# Altium schematic sheet OTHER.schdoc
size C; SheetNumber: 7; SheetTotal: 8
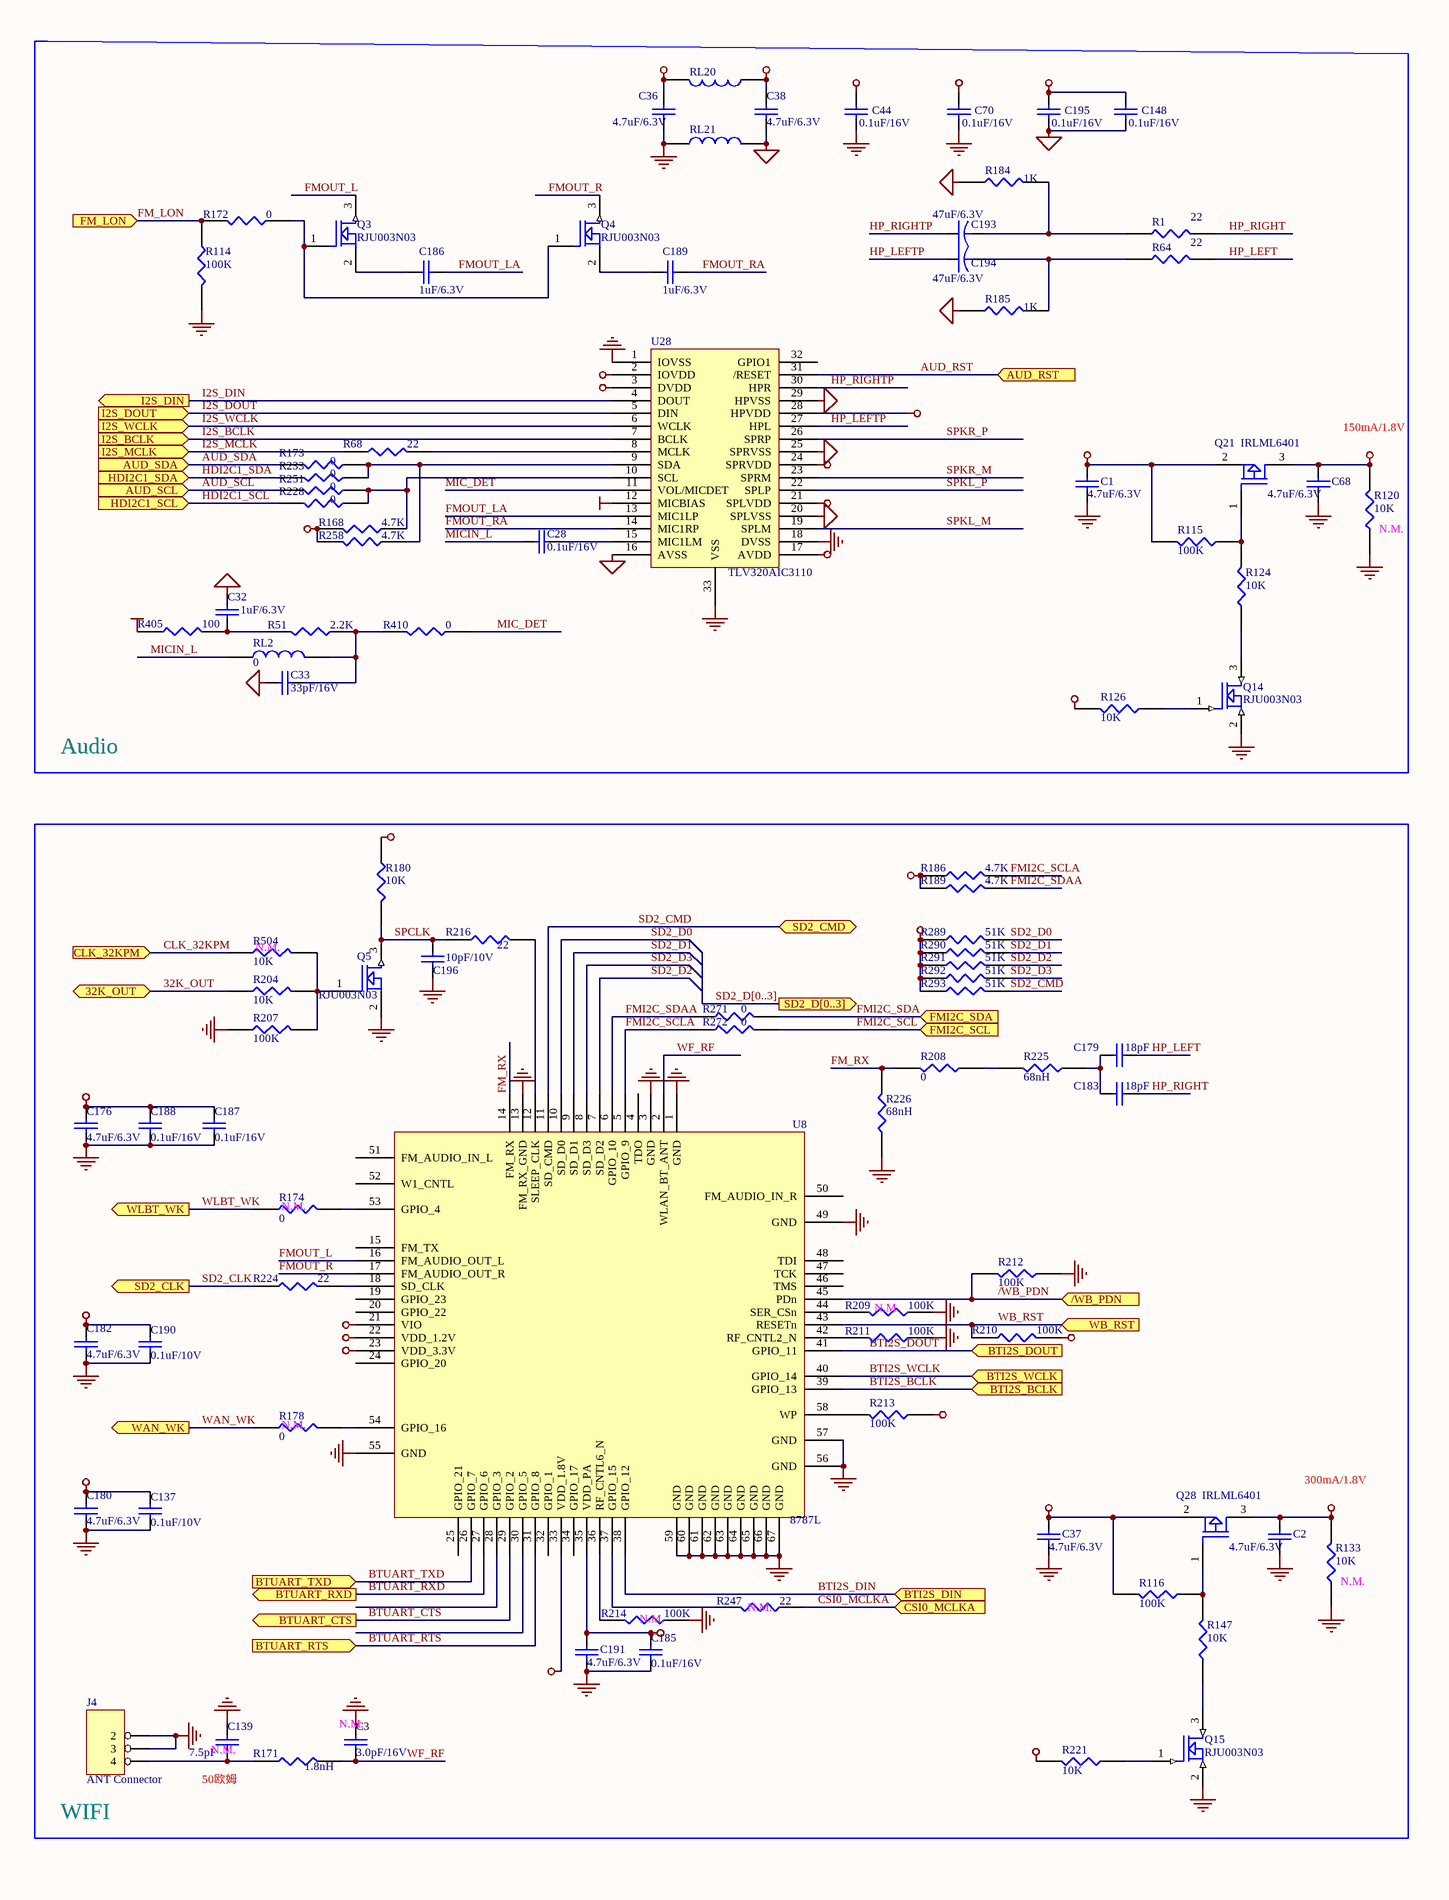
[diagram p0: OTHER.schdoc, left]
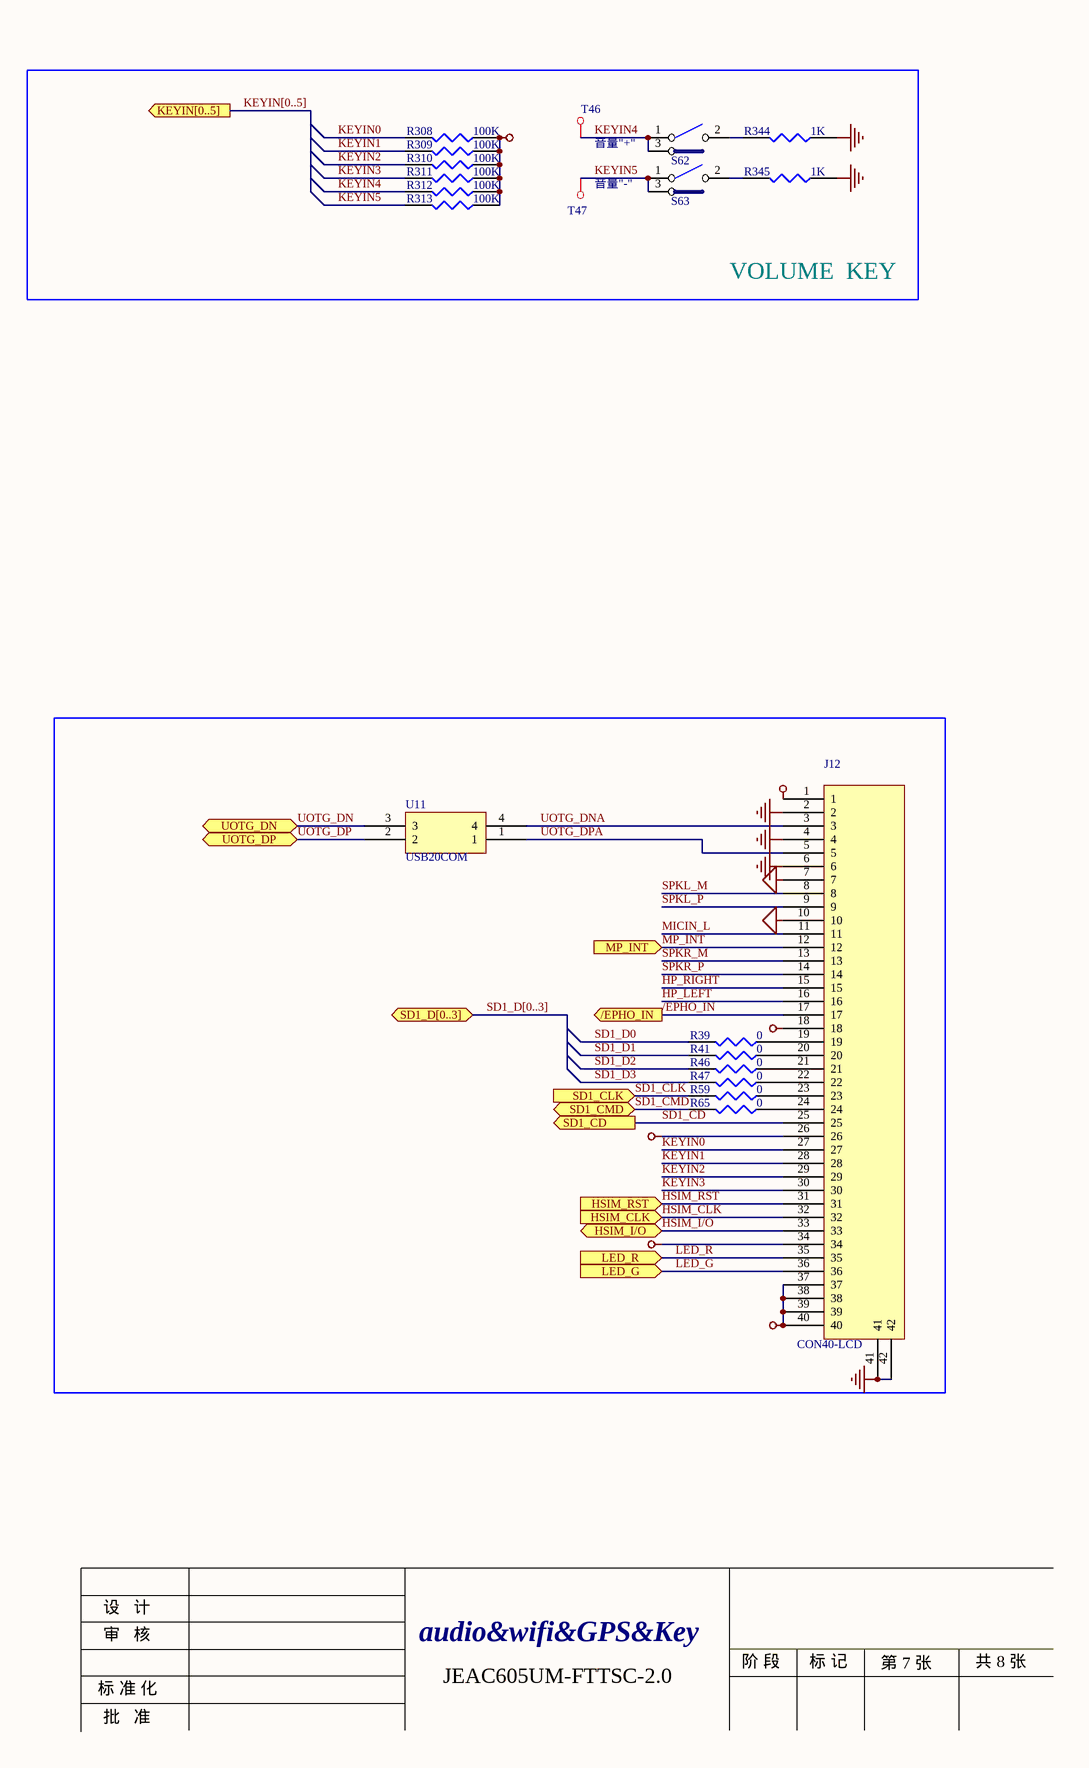
[diagram p1: OTHER.schdoc, right]

## Parts
C1  4.7uF/6.3V  [C0603]
C2  4.7uF/6.3V  [C0603]
C3  3.0pF/16V  [C0402]
C28  0.1uF/16V  [C0402]
C32  1uF/6.3V  [C0402]
C33  33pF/16V  [C0402]
C36  4.7uF/6.3V  [C0603]
C37  4.7uF/6.3V  [C0603]
C38  4.7uF/6.3V  [C0603]
C44  0.1uF/16V  [C0402]
C68  4.7uF/6.3V  [C0603]
C70  0.1uF/16V  [C0402]
C137  0.1uF/10V  [C0402]
C139  7.5pF  [C0402]
C148  0.1uF/16V  [C0402]
C176  4.7uF/6.3V  [C0603]
C179  18pF  [C0402]
C180  4.7uF/6.3V  [C0603]
C182  4.7uF/6.3V  [C0603]
C183  18pF  [C0402]
C185  0.1uF/16V  [C0402]
C186  1uF/6.3V  [C0402]
C187  0.1uF/16V  [C0402]
C188  0.1uF/16V  [C0402]
C189  1uF/6.3V  [C0402]
C190  0.1uF/10V  [C0402]
C191  4.7uF/6.3V  [C0603]
C193  47uF/6.3V  [C1206B1]
C194  47uF/6.3V  [C1206B1]
C195  0.1uF/16V  [C0402]
C196  10pF/10V  [C0402]
J4  ANT Connector  [J-AT-3-50-H]
J12  CON40-LCD  [j-con-40-0_5]
Q3  RJU003N03  [SOT-23-NPN]
Q4  RJU003N03  [SOT-23-NPN]
Q5  RJU003N03  [SOT-23-NPN]
Q14  RJU003N03  [SOT-23-NPN]
Q15  RJU003N03  [SOT-23-NPN]
Q21  IRLML6401  [SOT-23]
Q28  IRLML6401  [SOT-23]
R1  22  [R0402]
R39  0  [R0402]
R41  0  [R0402]
R46  0  [R0402]
R47  0  [R0402]
R51  2.2K  [R0402]
R59  0  [R0402]
R64  22  [R0402]
R65  0  [R0402]
R68  22  [R0402]
R114  100K  [R0402]
R115  100K  [R0402]
R116  100K  [R0402]
R120  10K  [R0402]
R124  10K  [R0402]
R126  10K  [R0402]
R133  10K  [R0402]
R147  10K  [R0402]
R168  4.7K  [R0402]
R171  1.8nH  [R0402]
R172  0  [R0402]
R173  0  [R0402]
R174  0  [R0402]
R178  0  [R0402]
R180  10K  [R0402]
R184  1K  [R0402]
R185  1K  [R0402]
R186  4.7K  [R0402]
R189  4.7K  [R0402]
R204  10K  [R0402]
R207  100K  [R0402]
R208  0  [R0402]
R209  100K  [R0402]
R210  100K  [R0402]
R211  100K  [R0402]
R212  100K  [R0402]
R213  100K  [R0402]
R214  100K  [R0402]
R216  22  [R0402]
R221  10K  [R0402]
R224  22  [R0402]
R225  68nH  [R0402]
R226  68nH  [R0402]
R228  0  [R0402]
R233  0  [R0402]
R247  22  [R0402]
R251  0  [R0402]
R258  4.7K  [R0402]
R271  0  [R0402]
R272  0  [R0402]
R289  51K  [R0402]
R290  51K  [R0402]
R291  51K  [R0402]
R292  51K  [R0402]
R293  51K  [R0402]
R308  100K  [R0402]
R309  100K  [R0402]
R310  100K  [R0402]
R311  100K  [R0402]
R312  100K  [R0402]
R313  100K  [R0402]
R344  1K  [R0402]
R345  1K  [R0402]
R405  100  [R0402]
R410  0  [R0402]
R504  10K  [R0402]
RL2  0  [L0402]
RL20  (no value)  [L0603]
RL21  (no value)  [L0603]
S62  SW SPST_side  [J-SW-3-1_225]  (value not drawn)
S63  SW SPST_side  [J-SW-3-1_225]  (value not drawn)
T46  Testpoint  [TP2_0]  (value not drawn)
T47  Testpoint  [TP2_0]  (value not drawn)
U8  8787L  [U-WM-67-0_605]
U11  USB20COM  [F-CHOKE-4-0805]
U28  TLV320AIC3110  [U-QFN-32-0_5]

## Blocks framed on the sheet
Audio: C1 C28 C32 C33 C36 C38 C44 C68 C70 C148 C186 C189 C193-C195 Q3 Q4 Q14 Q21 R1 R51 R64 R68 R114 R115 R120 R124 R126 R168 R172 R173 R184 R185 R228 R233 R251 R258 R405 R410 RL2 RL20 RL21 U28
VOLUME  KEY: R308-R313 R344 R345 S62 S63 T46 T47
WIFI: C2 C3 C37 C137 C139 C176 C179 C180 C182 C183 C185 C187 C188 C190 C191 C196 J4 Q5 Q15 Q28 R116 R133 R147 R171 R174 R178 R180 R186 R189 R204 R207-R214 R216 R221 R224-R226 R247 R271 R272 R289-R293 R504 U8

## Ports
32K_OUT (bidir), /EPHO_IN (out), /WB_PDN (in), AUD_RST (in), AUD_SCL (in), AUD_SDA (in), BTI2S_BCLK (in), BTI2S_DIN (in), BTI2S_DOUT (in), BTI2S_WCLK (in), BTUART_CTS (out), BTUART_RTS (in), BTUART_RXD (out), BTUART_TXD (in), CLK_32KPM (in), CSI0_MCLKA (in), FM_LON (in), FMI2C_SCL (in), FMI2C_SDA (in), HDI2C1_SCL (in), HDI2C1_SDA (in), HSIM_CLK (in), HSIM_I/O (bidir), HSIM_RST (in), I2S_BCLK (in), I2S_DIN (out), I2S_DOUT (in), I2S_MCLK (in), I2S_WCLK (in), KEYIN[0..5] (out), LED_G (in), LED_R (in), MP_INT (in), SD1_CD (out), SD1_CLK (in), SD1_CMD (bidir), SD1_D[0..3] (bidir), SD2_CLK (out), SD2_CMD (bidir), SD2_D[0..3] (out), UOTG_DN (bidir), UOTG_DP (bidir), WAN_WK (out), WB_RST (in), WLBT_WK (out)

## Nets
GND: C1.2 C2.1 C3.1 C36.1 C37.2 C44.2 C68.1 C70.2 C137.2 C139.1 C176.2 C180.1 C182.1 C185.2 C187.2 C188.2 C190.2 C191.1 C196.2 J4.2 J4.3 J12.2 J12.4 J12.6 J12.41 J12.42 Q5.2(S) Q14.2(S) Q15.2(S) R114.2 R120.1 R133.1 R207.1 R209.1 R211.1 R212.1 R214.1 R226.1 R344.1 R345.1 RL21.1 S62.6(GND) S62.7(GND) S63.6(GND) S63.7(GND) U8.1(GND) U8.3(GND) U8.13(FM_RX_GND) U8.49(GND) U8.55(GND) U8.56(GND) U8.57(GND) U8.59(GND) U8.60(GND) U8.61(GND) U8.62(GND) U8.63(GND) U8.64(GND) U8.65(GND) U8.66(GND) U8.67(GND) U28.1(IOVSS) U28.18(DVSS) U28.33(VSS)
HGND: C32.2 C33.2 C38.1 C148.2 C195.2 J12.7 J12.10 R184.1 R185.1 RL21.2 U28.16(AVSS) U28.20(SPLVSS) U28.25(SPRVSS) U28.29(HPVSS)
VAD_MICBIAS: R405.1 U28.12(MICBIAS)
VAD_MP3: C38.2 C148.1 C195.1 RL20.1 U28.17(AVDD) U28.21(SPLVDD) U28.24(SPRVDD) U28.28(HPVDD)
VAUD_DVDD: C68.2 C70.1 Q21.3(D) R120.2 U28.3(DVDD)
VBUS: J12.37 J12.38 J12.39 J12.40
VCC_1V8: C1.1 C37.1 Q21.2(S) Q28.2(S) R115.2 R116.2
VCC_3V: J12.1 R308.1 R309.1 R310.1 R311.1 R312.1 R313.1
VCC_CARD: J12.18
VCC_MP3: C36.2 C44.1 J12.26 R126.2 R168.2 R258.2 RL20.2 U28.2(IOVDD)
VCC_SIM: J12.34
VDD_WB18: C2.2 C137.1 C180.2 Q28.3(D) R133.2 R180.1 U8.33(VDD_1.8V)
VDD_WB33: C176.1 C185.1 C187.1 C188.1 C191.2 R186.1 R189.1 R210.2 R213.1 R221.2 R289.1 R290.1 R291.1 R292.1 R293.1 U8.21(VIO) U8.23(VDD_3.3V) U8.35(VDD_PA)
VDD_WBD12: C182.2 C190.1 U8.22(VDD_1.2V)
32K_OUT: R204.1 ; port 32K_OUT
/EPHO_IN: J12.17 ; port /EPHO_IN
/WB_PDN: R212.2 U8.45(PDn) ; port /WB_PDN
AUD_RST: U28.31(/RESET) ; port AUD_RST
AUD_SCL: R251.2 ; port AUD_SCL
AUD_SDA: R173.2 ; port AUD_SDA
BTI2S_BCLK: U8.39(GPIO_13) ; port BTI2S_BCLK
BTI2S_DIN: U8.38(GPIO_12) ; port BTI2S_DIN
BTI2S_DOUT: U8.41(GPIO_11) ; port BTI2S_DOUT
BTI2S_WCLK: U8.40(GPIO_14) ; port BTI2S_WCLK
BTUART_CTS: U8.29(GPIO_2) ; port BTUART_CTS
BTUART_RTS: U8.31(GPIO_8) ; port BTUART_RTS
BTUART_RXD: U8.27(GPIO_6) ; port BTUART_RXD
BTUART_TXD: U8.26(GPIO_7) ; port BTUART_TXD
CLK_32KPM: R504.1 ; port CLK_32KPM
CSI0_MCLKA: R247.1 ; port CSI0_MCLKA
FM_LON: R114.1 R172.2 ; port FM_LON
FM_RX: R208.2 R226.2 U8.14(FM_RX)
FMI2C_SCL: R272.2 ; port FMI2C_SCL
FMI2C_SCLA: R186.2 R272.1 U8.5(GPIO_9)
FMI2C_SDA: R271.2 ; port FMI2C_SDA
FMI2C_SDAA: R189.2 R271.1 U8.6(GPIO_10)
FMOUT_L: Q3.3(D) U8.16(FM_AUDIO_OUT_L)
FMOUT_LA: C186.2 U28.13(MIC1LP)
FMOUT_R: Q4.3(D) U8.17(FM_AUDIO_OUT_R)
FMOUT_RA: C189.2 U28.14(MIC1RP)
HDI2C1_SCL: R228.2 ; port HDI2C1_SCL
HDI2C1_SDA: R233.2 ; port HDI2C1_SDA
HP_LEFT: C179.1 J12.16 R64.2
HP_LEFTP: C194.1 U28.27(HPL)
HP_RIGHT: C183.1 J12.15 R1.2
HP_RIGHTP: C193.1 U28.30(HPR)
HSIM_CLK: J12.32 ; port HSIM_CLK
HSIM_I/O: J12.33 ; port HSIM_I/O
HSIM_RST: J12.31 ; port HSIM_RST
I2S_BCLK: U28.7(BCLK) ; port I2S_BCLK
I2S_DIN: U28.4(DOUT) ; port I2S_DIN
I2S_DOUT: U28.5(DIN) ; port I2S_DOUT
I2S_MCLK: R68.1 ; port I2S_MCLK
I2S_WCLK: U28.6(WCLK) ; port I2S_WCLK
KEYIN0: J12.27 R308.2
KEYIN1: J12.28 R309.2
KEYIN2: J12.29 R310.2
KEYIN3: J12.30 R311.2
KEYIN4: R312.2 S62.1(COMMON) S62.3(COMMON) T46.1(TP)
KEYIN5: R313.2 S63.1(COMMON) S63.3(COMMON) T47.1(TP)
LED_G: J12.36 ; port LED_G
LED_R: J12.35 ; port LED_R
MIC_DET: R410.1 U28.11(VOL/MICDET)
MICIN_L: C28.2 J12.11 RL2.1
MP_INT: J12.12 ; port MP_INT
SD1_CD: J12.25 ; port SD1_CD
SD1_CLK: R59.2 ; port SD1_CLK
SD1_CMD: R65.2 ; port SD1_CMD
SD1_D0: R39.2
SD1_D1: R41.2
SD1_D2: R46.2
SD1_D3: R47.2
SD2_CLK: R224.1 ; port SD2_CLK
SD2_CMD: R293.2 U8.11(SD_CMD) ; port SD2_CMD
SD2_D0: R289.2 U8.10(SD_D0)
SD2_D1: R290.2 U8.9(SD_D1)
SD2_D2: R291.2 U8.7(SD_D2)
SD2_D3: R292.2 U8.8(SD_D3)
SPCLK: C196.1 Q5.3(D) R180.2 R216.1
SPKL_M: J12.8 U28.19(SPLM)
SPKL_P: J12.9 U28.22(SPLP)
SPKR_M: J12.13 U28.23(SPRM)
SPKR_P: J12.14 U28.26(SPRP)
UOTG_DN: U11.3 ; port UOTG_DN
UOTG_DNA: J12.3 U11.4
UOTG_DP: U11.2 ; port UOTG_DP
UOTG_DPA: J12.5 U11.1
WAN_WK: R178.1 ; port WAN_WK
WB_RST: R210.1 U8.43(RESETn) ; port WB_RST
WF_RF: C3.2 R171.2 U8.2(WLAN_BT_ANT)
WLBT_WK: R174.1 ; port WLBT_WK
NetC28_1: C28.1 U28.15(MIC1LM)
NetC32_1: C32.1 R51.2 R405.2
NetC33_1: C33.1 R51.1 R410.2 RL2.2
NetC139_2: C139.2 J4.4 R171.1
NetC179_2: C179.2 C183.2 R225.1
NetC186_1: C186.1 Q3.2(S)
NetC189_1: C189.1 Q4.2(S)
NetC193_2: C193.2 R1.1 R184.2
NetC194_2: C194.2 R64.1 R185.2
NetJ12_19: J12.19 R39.1
NetJ12_20: J12.20 R41.1
NetJ12_21: J12.21 R46.1
NetJ12_22: J12.22 R47.1
NetJ12_23: J12.23 R59.1
NetJ12_24: J12.24 R65.1
NetQ3_1: Q3.1(G) Q4.1(G) R172.1
NetQ5_1: Q5.1(G) R204.2 R207.2 R504.2
NetQ14_1: Q14.1(G) R126.1
NetQ14_3: Q14.3(D) R124.1
NetQ15_1: Q15.1(G) R221.1
NetQ15_3: Q15.3(D) R147.1
NetQ21_1: Q21.1(G) R115.1 R124.2
NetQ28_1: Q28.1(G) R116.1 R147.2
NetR68_2: R68.2 U28.8(MCLK)
NetR168_1: R168.1 R228.1 R251.1 U28.10(SCL)
NetR173_1: R173.1 R233.1 R258.1 U28.9(SDA)
NetR174_2: R174.2 U8.53(GPIO_4)
NetR178_2: R178.2 U8.54(GPIO_16)
NetR208_1: R208.1 R225.2
NetR209_2: R209.2 U8.44(SER_CSn)
NetR211_2: R211.2 U8.42(RF_CNTL2_N)
NetR213_2: R213.2 U8.58(WP)
NetR214_2: R214.2 U8.36(RF_CNTL6_N)
NetR216_2: R216.2 U8.12(SLEEP_CLK)
NetR224_2: R224.2 U8.18(SD_CLK)
NetR247_2: R247.2 U8.37(GPIO_15)
NetR344_2: R344.2 S62.2(NO)
NetR345_2: R345.2 S63.2(NO)

Not connected (* = marked no-connect by the designer): U8 4(TDO) 15(FM_TX) 19(GPIO_23) 20(GPIO_22) 24(GPIO_20) 25(GPIO_21) 28(GPIO_3) 30(GPIO_5) 32(GPIO_1) 34(GPIO_17) 46(TMS) 47(TCK) 48(TDI) 50(FM_AUDIO_IN_R) 51(FM_AUDIO_IN_L) 52(W1_CNTL); U28 32(GPIO1)

## Buses and harness runs
bus KEYIN[0..5] = port KEYIN[0..5]
bus SD1_D[0..3] = port SD1_D[0..3]
bus SD2_D[0..3] = port SD2_D[0..3]

## Notes on the sheet
- (near T46) 音量"+"
- 150mA/1.8V
- (near T47) 音量"-"
- (near R120) N.M.
- (near R504) N.M.
- (near R174) N.M.
- (near R209) N.M.
- (near R178) N.M.
- 300mA/1.8V
- (near R133) N.M.
- (near R214) N.M.
- (near R247) N.M.
- (near C3) N.M.
- (near C139) 50欧姆
- (near C139) N.M.
- 设   计
- 审   核
- audio&wifi&GPS&Key
- 标 准 化
- 批   准
- JEAC605UM-FTTSC-2.0
- 阶 段
- 标 记
- 第 7 张
- 共 8 张

## Library data of the parts
C1-C3 C28 C32 C33 C36-C38 C44 C68 C70 C137 C139 C148 C176 C179 C180 C182 C183 C185-C191 C195 C196 = CAP: Capacitor
C193 C194 = CAPACITOR
J4 = 4 HEADER: 4 Pin Header
Q3-Q5 Q14 Q15 = MOSFET N
Q21 Q28 = SI1021
R1 R39 R41 R46 R47 R51 R59 R64 R65 R68 R114-R116 R120 R124 R126 R133 R147 R168 R171-R174 R178 R180 R184-R186 R189 R204 R207-R214 R216 R221 R224-R226 R228 R233 R247 R251 R258 R271 R272 R289-R293 R308-R313 R344 R345 R405 R410 R504 = RES1
RL2 RL20 RL21 = INDUCTOR